# Altium schematic sheet CAMERA_INTERFACE.SchDoc
size B; SheetNumber: 5; SheetTotal: 5
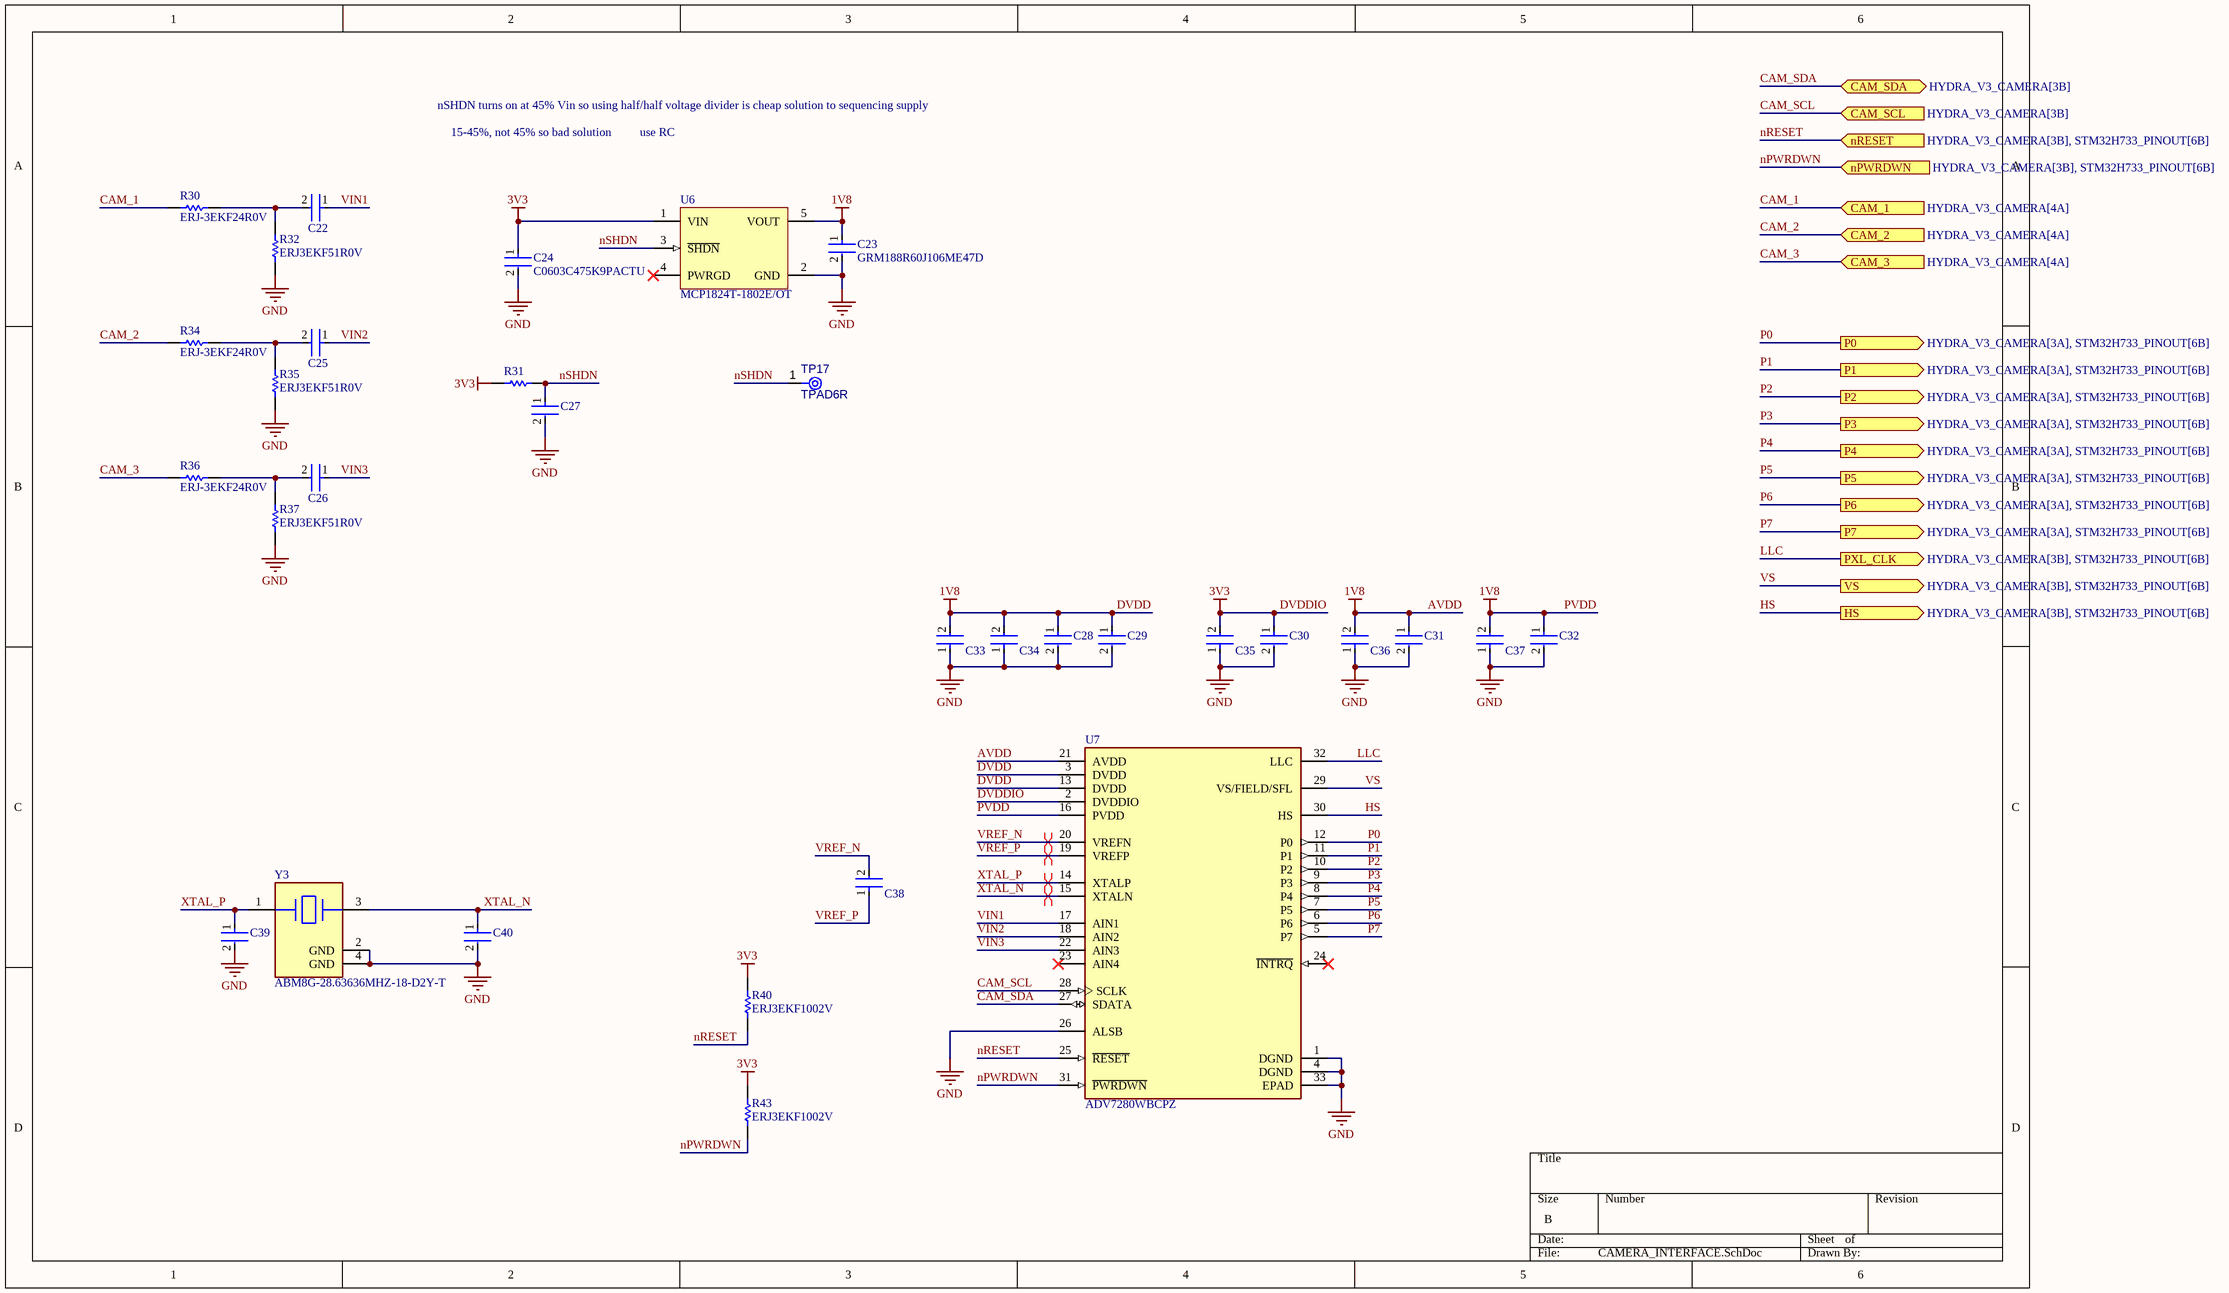
[diagram p0: CAMERA_INTERFACE.SchDoc]

## Parts
C22  C0402C104K8PACTU  [FP-C0402-BB-MFG]  (value not drawn)
C23  GRM188R60J106ME47D  [FP-GRM188-0_1-e0_2_0_55-IPC_A]
C24  C0603C475K9PACTU  [FP-C0603-CG-MFG]
C25  C0402C104K8PACTU  [FP-C0402-BB-MFG]  (value not drawn)
C26  C0402C104K8PACTU  [FP-C0402-BB-MFG]  (value not drawn)
C27  C0603C475K9PACTU  [FP-C0603-CG-MFG]  (value not drawn)
C28  CC0603KRX7R9BB103  [FP-CC0603-DA-MFG]  (value not drawn)
C29  CC0603KRX7R9BB103  [FP-CC0603-DA-MFG]  (value not drawn)
C30  CC0603KRX7R9BB103  [FP-CC0603-DA-MFG]  (value not drawn)
C31  CC0603KRX7R9BB103  [FP-CC0603-DA-MFG]  (value not drawn)
C32  CC0603KRX7R9BB103  [FP-CC0603-DA-MFG]  (value not drawn)
C33  C0402C104K8PACTU  [FP-C0402-BB-MFG]  (value not drawn)
C34  C0402C104K8PACTU  [FP-C0402-BB-MFG]  (value not drawn)
C35  C0402C104K8PACTU  [FP-C0402-BB-MFG]  (value not drawn)
C36  C0402C104K8PACTU  [FP-C0402-BB-MFG]  (value not drawn)
C37  C0402C104K8PACTU  [FP-C0402-BB-MFG]  (value not drawn)
C38  C0402C104K8PACTU  [FP-C0402-BB-MFG]  (value not drawn)
C39  C0603C470J1GACTU  [FP-C0603C-CF-MFG]  (value not drawn)
C40  C0603C470J1GACTU  [FP-C0603C-CF-MFG]  (value not drawn)
R30  ERJ-3EKF24R0V  [RESC1608X55X30ML15T15]
R31  ERJ3EKF1002V  [RESC1609X55X30LL15T15]  (value not drawn)
R32  ERJ3EKF51R0V  [RESC1608X55X30NL15T15]
R34  ERJ-3EKF24R0V  [RESC1608X55X30ML15T15]
R35  ERJ3EKF51R0V  [RESC1608X55X30NL15T15]
R36  ERJ-3EKF24R0V  [RESC1608X55X30ML15T15]
R37  ERJ3EKF51R0V  [RESC1608X55X30NL15T15]
R40  ERJ3EKF1002V  [RESC1609X55X30LL15T15]
R43  ERJ3EKF1002V  [RESC1609X55X30LL15T15]
TP17  TPAD6R  [TP06R]  (no BOM)
U6  MCP1824T-1802E/OT  [SOT-23-OT5_M]
U7  ADV7280WBCPZ  [FP-CP-32-12-MFG]
Y3  ABM8G-28.63636MHZ-18-D2Y-T  [FP-ABM8G-MFG]

## Ports
CAM_1 (in, see HYDRA_V3_CAMERA[4A]), CAM_2 (in, see HYDRA_V3_CAMERA[4A]), CAM_3 (in, see HYDRA_V3_CAMERA[4A]), CAM_SCL (in, see HYDRA_V3_CAMERA[3B]), CAM_SDA (bidir, see HYDRA_V3_CAMERA[3B]), HS (out, see HYDRA_V3_CAMERA[3B], STM32H733_PINOUT[6B]), nPWRDWN (in, see HYDRA_V3_CAMERA[3B], STM32H733_PINOUT[6B]), nRESET (in, see HYDRA_V3_CAMERA[3B], STM32H733_PINOUT[6B]), P0 (out, see HYDRA_V3_CAMERA[3A], STM32H733_PINOUT[6B]), P1 (out, see HYDRA_V3_CAMERA[3A], STM32H733_PINOUT[6B]), P2 (out, see HYDRA_V3_CAMERA[3A], STM32H733_PINOUT[6B]), P3 (out, see HYDRA_V3_CAMERA[3A], STM32H733_PINOUT[6B]), P4 (out, see HYDRA_V3_CAMERA[3A], STM32H733_PINOUT[6B]), P5 (out, see HYDRA_V3_CAMERA[3A], STM32H733_PINOUT[6B]), P6 (out, see HYDRA_V3_CAMERA[3A], STM32H733_PINOUT[6B]), P7 (out, see HYDRA_V3_CAMERA[3A], STM32H733_PINOUT[6B]), PXL_CLK (out, see HYDRA_V3_CAMERA[3B], STM32H733_PINOUT[6B]), VS (out, see HYDRA_V3_CAMERA[3B], STM32H733_PINOUT[6B])

## Nets
AVDD: C23.1 C28.1 C29.1 C31.1 C32.1 C33.2 C34.2 C36.2 C37.2 U6.5(VOUT) U7.3(DVDD) U7.13(DVDD) U7.16(PVDD) U7.21(AVDD)  [also labelled 1V8, DVDD, PVDD]
DVDDIO: C24.1 C30.1 C35.2 R31.1 R40.2 R43.2 U6.1(VIN) U7.2(DVDDIO)  [also labelled 3V3]
GND: C23.2 C24.2 C27.2 C28.2 C29.2 C30.2 C31.2 C32.2 C33.1 C34.1 C35.1 C36.1 C37.1 C39.2 C40.2 R32.1 R35.1 R37.1 U6.2(GND) U7.1(DGND) U7.4(DGND) U7.26(ALSB) U7.33(EPAD) Y3.2(GND) Y3.4(GND)
CAM_1: R30.1 ; port CAM_1
CAM_2: R34.1 ; port CAM_2
CAM_3: R36.1 ; port CAM_3
CAM_SCL: U7.28(SCLK) ; port CAM_SCL
CAM_SDA: U7.27(SDATA) ; port CAM_SDA
HS: U7.30(HS) ; port HS
LLC: U7.32(LLC) ; port PXL_CLK
nPWRDWN: R43.1 U7.31(~{PWRDWN}) ; port nPWRDWN
nRESET: R40.1 U7.25(~{RESET}) ; port nRESET
nSHDN: C27.1 R31.2 TP17.1(TP) U6.3(~{SHDN})
P0: U7.12(P0) ; port P0
P1: U7.11(P1) ; port P1
P2: U7.10(P2) ; port P2
P3: U7.9(P3) ; port P3
P4: U7.8(P4) ; port P4
P5: U7.7(P5) ; port P5
P6: U7.6(P6) ; port P6
P7: U7.5(P7) ; port P7
VIN1: C22.1 U7.17(AIN1)
VIN2: C25.1 U7.18(AIN2)
VIN3: C26.1 U7.22(AIN3)
VREF_N: C38.2 U7.20(VREFN)
VREF_P: C38.1 U7.19(VREFP)
VS: U7.29(VS/FIELD/SFL) ; port VS
XTAL_N: C40.1 U7.15(XTALN) Y3.3
XTAL_P: C39.1 U7.14(XTALP) Y3.1
NetC22_2: C22.2 R30.2 R32.2
NetC25_2: C25.2 R34.2 R35.2
NetC26_2: C26.2 R36.2 R37.2

Not connected (* = marked no-connect by the designer): U6 4(PWRGD)*; U7 23(AIN4)* 24(~{INTRQ})*

## Layout directives
differential pair: VREF_N, VREF_P, XTAL_N, XTAL_P

## Notes on the sheet
- nSHDN turns on at 45% Vin so using half/half voltage divider is cheap solution to sequencing supply
- 15-45%, not 45% so bad solution
- use RC

## Library data of the parts
C22 C25 C26 C33-C38 = CMP-2008-02046-2: CAP CER 0.1UF 10V X5R 0402; Manufacturer: Kemet; Material: Ceramic; Capacitance: 0.10 μF; Temperature Coefficient: 15%; Tolerance: 0.1; Value: 0.10 μF; Package: C0402-BB; Temperature: -55°C to +125°C; ComponentLink2Description: Datasheet; Temperature Characteristic: X5R; Device Class L1: Passive Components; Height: 0.55mm; Lead Free: Yes; ComponentLink2URL: https://content.kemet.com/datasheets/KEM_C1002_X7R_SMD.pdf; Device Class L2: Capacitors; Temperature Range Low: -55°C; Temperature Range High: +125°C; RoHS: TRUE; Octopart: https://octopart.com/c0402c104k8pactu-kemet-140039; Automotive: No; Mouser Description: Capacitor 100 nF 10 VDC 0402; Category: Cap; Voltage Rating: 10 V; Digikey Description: CAP CER 0.1UF 10V X5R 0402; Ipc Land Pattern Name: CAPC10050X50; Device Class L3: Ceramic Capacitors; Manufacturer Part Number: C0402C104K8PACTU
C23 = CMP-2006-02792-2: Chip Multilayer Ceramic Capacitors for General Purpose, 0603, 10uF, X5R, 15%, 20%, 6.3V; Packaging: Tape and Reel; Voltage Rating (DC): 6.3V; Width: 0.031inch; Termination: SMD/SMT; Dielectric: X5R; Package Quantity: 4000; Voltage Rating: 6.3V; Capacitance: 10uF; Case/Package: 0603; Min Operating Temperature: -55°C; Voltage: 6.3V; Length: 1.6mm; Thickness: 0.035inch; Lead Free: Lead Free; Depth: 0.8mm; Case Code (Imperial): 0603; Max Operating Temperature: 85°C; Material: Ceramic; Height: 0.8mm; Tolerance: 20%; Mount: Surface Mount; REACH SVHC: No SVHC; Radiation Hardening: No; Case Code (Metric): 1608
C24 C27 = CMP-2006-02256-2: CAP CER 4.7UF 6.3V X5R 0603; Manufacturer: Kemet; Temperature Coefficient: 15%; Tolerance: 10%; Material: Ceramic; Device Class L3: Ceramic Capacitors; RoHS: TRUE; Value: 4.7uF; Lead Free: Yes; ComponentLink2Description: Datasheet; Mouser Description: Multilayer Ceramic Capacitors MLCC - SMD/SMT 6.3volts 4.7uF X5R 10%; Package: C0603-CG; Digikey Description: CAP CER 4.7UF 6.3V X5R 0603; ComponentLink2URL: https://content.kemet.com/datasheets/KEM_C1006_X5R_SMD.pdf; Category: Cap; Temperature Range Low: -55°C; Capacitance: 4.7uF; Temperature: -55°C to +85°C; Octopart: https://octopart.com/c0603c475k9pactu-kemet-104242; Ipc Land Pattern Name: CAPC16080X80; Voltage Rating: 6.3V; Temperature Range High: +85°C; Height: 0.9mm; Temperature Characteristic: X5R; Device Class L1: Passive Components; Manufacturer Part Number: C0603C475K9PACTU; Automotive: No; Device Class L2: Capacitors
C28-C32 = CMP-2100-03600-2: CAP CER 10000PF 50V X7R 0603; Manufacturer: YAGEO; Tolerance: 0.1; Material: Ceramic; Temperature Coefficient: 15%; Value: 10 nF; Mouser Description: Multilayer Ceramic Capacitor, CC Series, 0.01 - F, - 10%, X7R, 50 V, 0603 [1608 Metric]; Digikey Description: CAP CER 10000PF 50V X7R 0603; Height: 0.9mm; Category: Cap; Temperature Characteristic: X7R; Footprint Url: http://www.yageo.com/exep/pages/download/literatures/UPY-C_GEN_24.pdf; Lead Free: Yes; Voltage Rating: 50 V; Manufacturer Part Number: CC0603KRX7R9BB103; Temperature: -55°C to +125°C; Device Class L3: Ceramic Capacitors; ComponentLink2Description: Datasheet; Voltage: 50 V; Package: CC0603-DA; Octopart: https://octopart.com/cc0603krx7r9bb103-yageo-192938; Automotive: No; Temperature Range High: +125°C; Temperature Range Low: -55°C; RoHS: TRUE; Device Class L1: Passive Components; ComponentLink2URL: http://www.yageo.com/documents/recent/UPY-GPHC_X7R_6.3V-to-50V_18.pdf; Device Class L2: Capacitors; Capacitance: 10 nF
C39 C40 = CMP-2006-03321-2: CAP CER 47PF 100V 5% NP0 0603; Manufacturer: KEMET; Temperature Characteristic: C0G; Temperature Coefficient: 30ppm/°C; Automotive Grade: Grade 1; Material: Ceramic; Tolerance: 0.05; Digikey Description: CAP CER 47PF 100V 5% NP0 0603; Value: 47 pF; Category: Cap; Device Class L2: Capacitors; Device Class L1: Passive Components; Package: C0603C-CF; Octopart: https://octopart.com/c0603c470j1gactu-kemet-3768219; Lead Free: Yes; Temperature Range High: +125°C; Device Class L3: Ceramic Capacitors; Height: 0.87mm; Temperature: -55°C to +125°C; Mouser Description: Multilayer Ceramic Capacitors MLCC - SMD/SMT 100volts 47pF C0G 5%; Automotive: Yes; Capacitance: 47 pF; RoHS: TRUE; ComponentLink2URL: https://api.kemet.com/component-edge/download/datasheet/C0603C100J5GACAUTO.pdf; Voltage Rating: 100 V; Manufacturer Part Number: C0603C470J1GACTU; ComponentLink2Description: Datasheet; Temperature Range Low: -55°C
R30 R34 R36 = CMP-1012-00325-2: Manufacturer: Panasonic; Part Number: ERJ-3EKF24R0V
R31 R40 R43 = CMP-1012-00623-3: Chip Resistor, 10 KOhm, +/- 1%, 0.1 W, -55 to 155 degC, 0603 (1608 Metric), RoHS, Tape and Reel; Manufacturer: Panasonic; Voltage Rating: 75V; Case\/Package: 0603; Power Rating: 100mW; Resistance: 10KOhm; Temperature Coefficient: 100ppm\/degreesC; Number of Pins: 2; Package Reference: 603; Depth: 0.8mm; Mount: SurfaceMount; Package Description: 2-Pin Surface Mount Device, Body 1.6 x 0.85 mm; Datasheet Version: 02/2017; Length: 1.6mm; Lead Free: LeadFree; Height: 0.45mm; Number of Terminations: 2; Max Power Dissipation: 100mW; Min Operating Temperature: -55degC; Datasheet URL: https://industrial.panasonic.com/cdbs/www-data/pdf/RDA0000/AOA0000C304.pdf; Termination: SMD/SMT; Case Code (Metric): 1608; Case Code (Imperial): 0603; Tolerance: 1%; Max Operating Temperature: 155degC; RoHSCompliant: true; Voltage Rating (DC): 75V; Radiation Hardening: No; Packaging: TapeandReel; Composition: ThickFilm; Mounting Technology: SurfaceMount; Manufacturer URL: http://www.panasonic.com/; Width: 0.031inch; REACH SVHC: NoSVHC; Contact Plating: Tin; Military Standard: Not; Package Quantity: 1
R32 R35 R37 = CMP-2000-00547-1: Manufacturer: Panasonic; Part Number: ERJ3EKF51R0V
TP17 = CMP-00028-00002-2: 0.6mm round; Pins: 1
U6 = CMP-0136-00652-1: 300 mA, Low Voltage, Low Quiescent Current LDO Regulator, 5-Pin SOT-23, Extended Temperature, Tape and Reel; DatasheetVersion: revA, Aug-2007; PackageDescription: 5-Lead Plastic Small Outline Transistor (OT) [SOT-23]; Code_IPC: SOT23-5; PackageReference: SOT-23-OT5; PackageVersion: revBB, Aug-2009
U7 = CMP-09080-000010-1: IC VIDEO DECODER SDTV 32-LFCSP; Min Supply Voltage: 1.71V; Max Supply Voltage: 1.89V; Resolution: 10b; Interface: I2C; Number of Bits: 10; Number of Inputs: 4; Operating Supply Current: 70mA; Number of A/D Converters: 1; REACH SVHC: No SVHC; Case/Package: LFCSP EP; Max Operating Temperature: 105°C; Number of Pins: 32; Length: 5.1mm; RoHS Compliant: Yes; Width: 5.1mm; Mount: Surface Mount; Package Quantity: 490; Contact Plating: Tin; Min Operating Temperature: -40°C; Height: 0.75mm; Series: AUTOMOTIVE; Lead Free: Contains Lead; Packaging: Tray
Y3 = CMP-27762-014063-1: Crystal 28.63636MHz ±20ppm (Tol) ±30ppm (Stability) 18pF FUND 50Ω 4-Pin SMD T/R; ESR (Equivalent Series Resistance): 50R; Operating Frequency: 28.6 MHz; Length: 3.2mm; Lead Free: Lead Free; Width: 2.5mm; Termination: SMD/SMT; Series: ABM8G; Max Operating Temperature: 85°C; REACH SVHC: Yes; Mount: Surface Mount; Case/Package: SMD/SMT; Frequency Tolerance: 20ppm; Number of Pins: 4; Load Capacitance: 18pF; Tolerance: 20ppm; Series Resistance: 50R; Height: 1mm; Frequency: 28.63636MHz; Min Operating Temperature: -40°C; Frequency Stability: 30ppm; Package Quantity: 1000; Packaging: Tape and Reel; Radiation Hardening: No